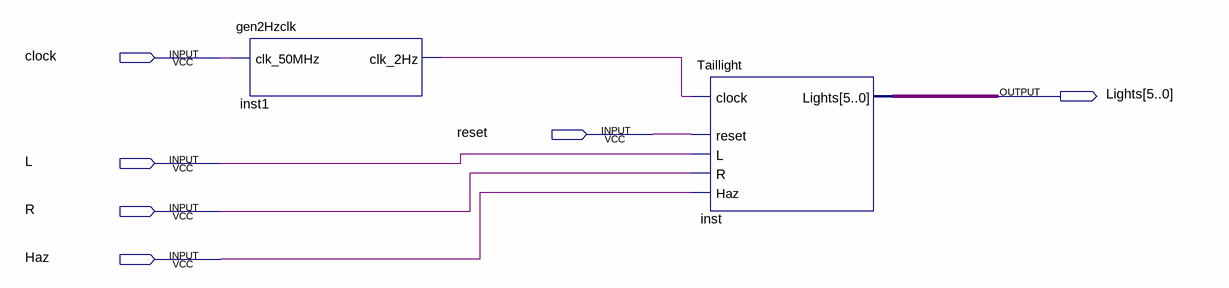
[diagram p0: schematic sheet]
// Quartus schematic T_bird.bdf as structural Verilog: 2 symbols, 6 pins
module T_bird (
  input  clock,
  input  reset,
  input  L,
  input  R,
  input  Haz,
  output [5:0] Lights
);

  wire inst1_clk_2hz;

  gen2Hzclk inst1 (.clk_50MHz(clock), .clk_2Hz(inst1_clk_2hz));
  Taillight inst (.clock(inst1_clk_2hz), .reset(reset), .L(L), .R(R), .Haz(Haz), .Lights(Lights));
endmodule
